# Altium schematic sheet Compensador.SchDoc
size A4; DocumentNumber: 4; SheetNumber: 4; SheetTotal: 7
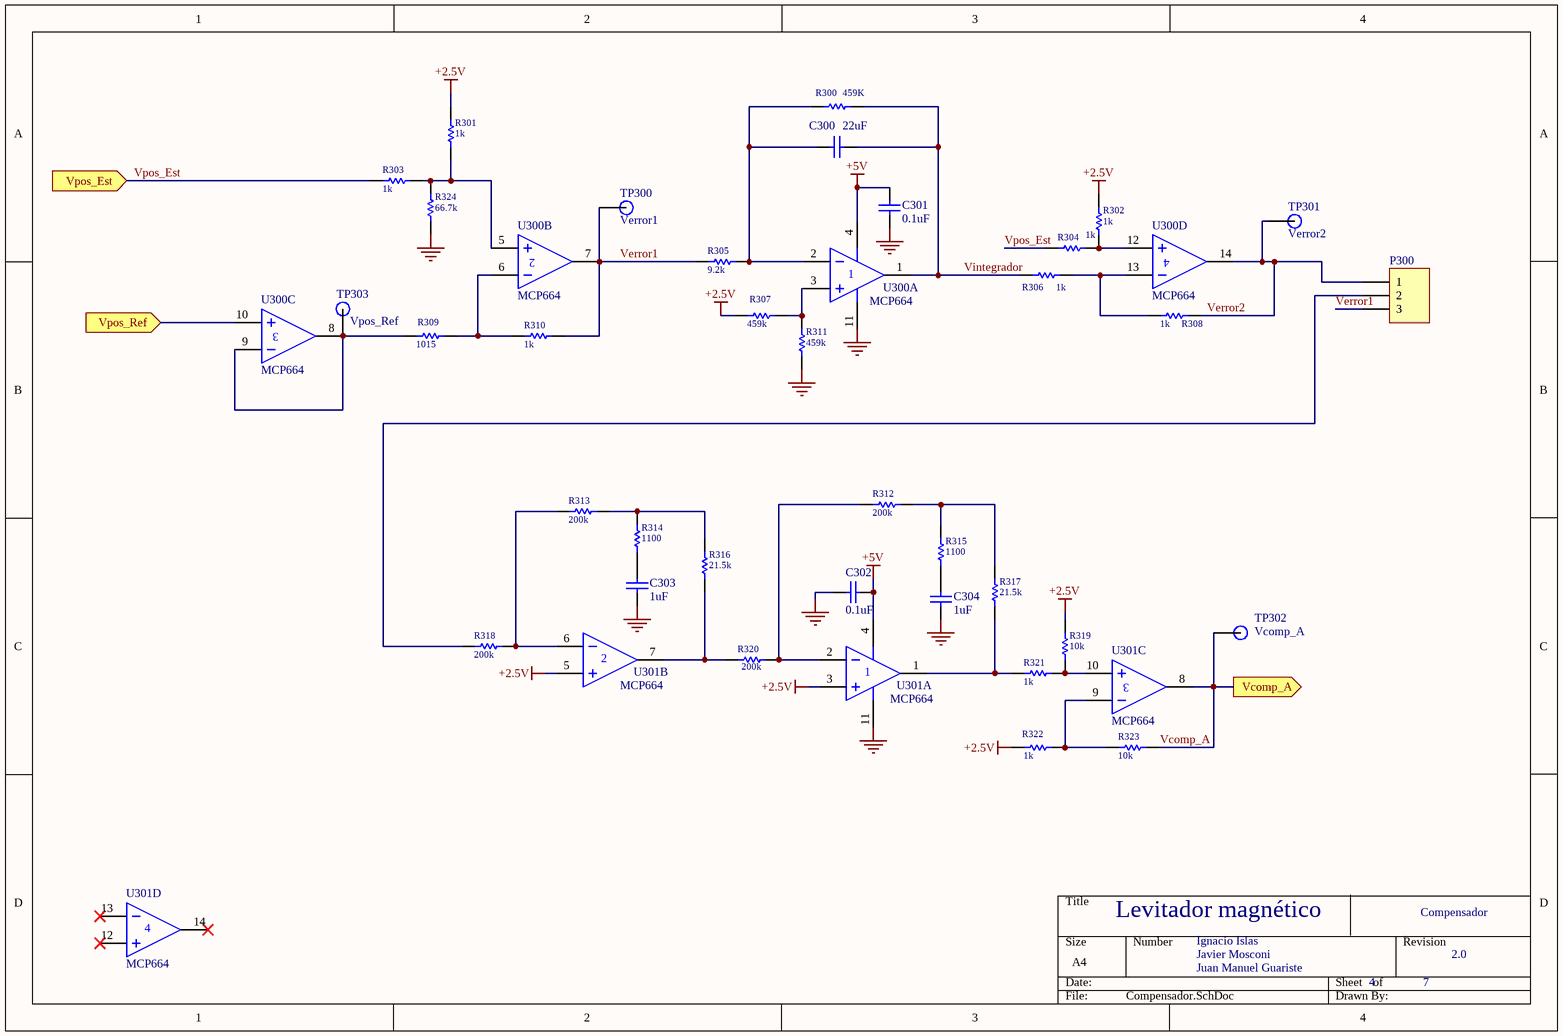
[diagram p0: Compensador.SchDoc]

## Parts
C300  value 22uF  [C1206]  (hidden comment: Capacitor)
C301  value 0.1uF  [C1206]  (hidden comment: Capacitor)
C302  value 0.1uF  [C1206]  (hidden comment: Capacitor)
C303  value 1uF  [C1206]  (hidden comment: Capacitor)
C304  value 1uF  [C1206]  (hidden comment: Capacitor)
P300  Header 3  [HDR1X3]  (value not drawn)
R300  459K  [R1206]
R301  1k  [R1206]
R302  1k  [R1206]
R303  1k  [R1206]
R304  1k  [R1206]
R305  9.2k  [R1206]
R306  1k  [R1206]
R307  459k  [R1206]
R308  1k  [R1206]
R309  1015  [R1206]
R310  1k  [R1206]
R311  459k  [R1206]
R312  200k  [R1206]
R313  200k  [R1206]
R314  1100  [R1206]
R315  1100  [R1206]
R316  21.5k  [R1206]
R317  21.5k  [R1206]
R318  200k  [R1206]
R319  10k  [R1206]
R320  200k  [R1206]
R321  1k  [R1206]
R322  1k  [R1206]
R323  10k  [R1206]
R324  66.7k  [R1206]
TP300  Verror1  [TestPoint Keystone 5000 Silver-Red]
TP301  Verror2  [TestPoint Keystone 5000 Silver-Red]
TP302  Vcomp_A  [TestPoint Keystone 5000 Silver-Red]
TP303  Vpos_Ref  [TestPoint Keystone 5000 Silver-Red]
U300  MCP664  [SOIC14]  (parts A,B,C,D of 4)
U301  MCP664  [SOIC14]  (parts A,B,C,D of 4)

## Ports
Vcomp_A (out), Vpos_Est (in), Vpos_Ref (in)

## Nets
+2.5V: R301.2 R302.2 R307.1 R319.2 R322.1 U301.3(IN+) U301.5(IN+)
+5V: C301.2 C302.2 U300.4(V+) U301.4(V+)
GND: C301.1 C302.1 C303.2 C304.1 R311.1 R324.2 U300.11(V-) U301.11(V-)
Vcomp_A: R323.2 TP302.1 U301.8(OUT) ; port Vcomp_A
Verror1: P300.3 R305.1 R310.2 TP300.1 U300.7(OUT)
Verror2: P300.1 R308.2 TP301.1 U300.14(OUT)
Vintegrador: C300.1 R300.2 R306.1 U300.1(OUT)
Vpos_Est: R303.1 R304.1 ; port Vpos_Est
Vpos_Ref: U300.10(IN+) ; port Vpos_Ref
NetC300_2: C300.2 R300.1 R305.2 U300.2(IN-)
NetC303_1: C303.1 R314.1
NetC304_2: C304.2 R315.1
NetP300_2: P300.2 R318.1
NetR301_1: R301.1 R303.2 R324.1 U300.5(IN+)
NetR302_1: R302.1 R304.2 U300.12(IN+)
NetR306_2: R306.2 R308.1 U300.13(IN-)
NetR307_2: R307.2 R311.2 U300.3(IN+)
NetR309_1: R309.1 TP303.1 U300.8(OUT) U300.9(IN-)
NetR309_2: R309.2 R310.1 U300.6(IN-)
NetR312_1: R312.1 R320.2 U301.2(IN-)
NetR312_2: R312.2 R315.2 R317.2
NetR313_1: R313.1 R318.2 U301.6(IN-)
NetR313_2: R313.2 R314.2 R316.2
NetR316_1: R316.1 R320.1 U301.7(OUT)
NetR317_1: R317.1 R321.1 U301.1(OUT)
NetR319_1: R319.1 R321.2 U301.10(IN+)
NetR322_2: R322.2 R323.1 U301.9(IN-)

Not connected (* = marked no-connect by the designer): U301 12(IN+)* 13(IN-)* 14(OUT)*

## Notes on the sheet
- Levitador magnético
- Compensador
- Ignacio Islas
- Javier Mosconi
- Juan Manuel Guariste
- 2.0

## Library data of the parts
C300 = Capacitor: CAP CER 22UF 16V X5R 1206; Manufacturer: Samsung Electro-Mechanics; Mfr PN: CL31A226MOCLNNC; Supplier 1 PN: 1276-2728-1-ND; Supplier 1: Digi-Key
C301 C302 = Capacitor: CAP CER 0.1UF 50V X7R 1206; Manufacturer: Venkel; Mfr PN: C1206X7R500-104KNE; Supplier 1: Digi-Key; Supplier 1 PN: 2679-C1206X7R500-104KNETR-ND
C303 C304 = Capacitor: CAP CER 1UF 25V X7R 1206; Manufacturer: CAL-CHIP ELECTRONICS, INC.; Mfr PN: GMC31X7R105M25NT; Supllier 1: Digi-Key; Supplier 1 PN: 2571-GMC31X7R105M25NTTR-ND
P300 = Header 3: TERM BLK 3P SIDE ENT 2.54MM PCB; Manufacturer: TE Connectivity AMP Connectors; Mfr PN: 282834-3; Link: https://www.digikey.com/en/products/detail/te-connectivity-amp-connectors/282834-3/1153264; Supplier 1 PN: A98334-ND; Supplier 1: Digi-Key
R300 R307 = R1206: RES 459K OHM 1% 1/4W 1206; Manufacturer: KOA Speer Electronics, Inc.; Mfr PN: RN73H2BTTD4593F10; PackageReference: 1206; Supplier 1: Digi-Key; Tolerance: 1%; Supplier 1 PN: 2019-RN73H2BTTD4593F10CT-ND
  R300: Value: 459K
  R307: Value: 459k
R301-R303 R306 R308 R310 R321 R322 = R1206: RES 1K OHM 1% 1/4W 1206; Manufacturer: Stackpole Electronics Inc; Mfr PN: RMCF1206FT1K00; Supplier 1: Digi-Key; Value: 1k; Tolerance: 1%; Supplier 1 PN: RMCF1206FT1K00CT-ND
  R301: PackageReference: 1206; PackageDescription: SMT Chip Resistor
  R303 R306 R308 R310 R321 R322: PackageReference: 1206
R304 = R1206: RES 1K OHM 1% 1/4W 1206; Mfr PN: RMCF1206FT1K00; Manufacturer: Stackpole Electronics Inc; Supplier 1 PN: RMCF1206FT1K00CT-ND; Supplier 1: Digi-Key; Value: 1k; Tolerance: 1%
R305 R311 = R1206: RES 9.2K OHM 1% 1/4W 1206; Manufacturer: KOA Speer Electronics, Inc.; Mfr PN: RN73H2BTTD9201F10; PackageReference: 1206; Supplier 1: Digi-Key; Tolerance: 1%; Supplier 1 PN: 2019-RN73H2BTTD9201F10CT-ND
  R305: Value: 9.2k
  R311: Value: 459k
R309 = R1206: RES 1.01K OHM 0.1% 1/3W 1206; Manufacturer: Stackpole Electronics Inc; Mfr PN: RNCF1206BTE1K01; Tolerance: 1%; Supplier 1: Digi-Key; Value: 1015; Supplier 1 PN: RNCF1206BTE1K01
R312 R313 R318 R320 = R1206: RES 200K OHM 1% 1/4W 1206; Manufacturer: YAGEO; Mfr PN: RC1206FR-07200KL; PackageReference: 1206; Supplier 1: Digi-Key; Value: 200k; Tolerance: 1%; Supplier 1 PN: 311-200KFRCT-ND
R314 R315 = R1206: RES 1.1K OHM 1% 1/4W 1206; Manufacturer: YAGEO; Mfr PN: RC1206FR-071K1L; PackageReference: 1206; Supplier 1: Digi-Key; Value: 1100; Tolerance: 1%; Supplier 1 PN: 311-1.10KFRCT-ND
R316 R317 = R1206: RES 21.5K OHM 1% 1/4W 1206; Manufacturer: YAGEO; Mfr PN: RC1206FR-0721K5L; PackageReference: 1206; Supplier 1: Digi-Key; Value: 21.5k; Tolerance: 1%; Supplier 1 PN: 311-21.5KFRCT-ND
R319 R323 = R1206: RES 10K OHM 1% 1/4W 1206; Manufacturer: YAGEO; Mfr PN: RC1206FR-0710KL; PackageReference: 1206; Supplier 1: Digi-Key; Value: 10k; Tolerance: 1%; Supplier 1 PN: 311-10.0KFRCT-ND
R324 = R1206: RES 1K OHM 1% 1/4W 1206; Manufacturer: YAGEO; Mfr PN: RC1206FR-0766K5L; PackageReference: 1206; PackageDescription: SMT Chip Resistor; Supplier 1: Digi-Key; Value: 66.7k; Tolerance: 1%; Supplier 1 PN: 311-66.5KFRCT-ND
TP300-TP303 = Testpoint: PC TEST POINT MINIATURE RED; Manufacturer: Keystone Electronics; Mfr PN: 5000; Link: https://www.digikey.com/en/products/detail/keystone-electronics/5000/255326; Supplier 1: Digi-Key; Supplier 1 PN: 36-5000-ND
U300 U301 = MCP664: IC OPAMP GP 4 CIRCUIT 14TSSOP; Mfr PN: MCP664-E/ST; Manufacturer: Microchip Technology; Datasheet: https://ar.mouser.com/datasheet/2/268/20002194E-2448650.pdf; Supplier 1 PN: MCP664-E/ST-ND; Supplier 1: Digi-Key